# Altium project insulated_dc-dc_200W.PrjPcb
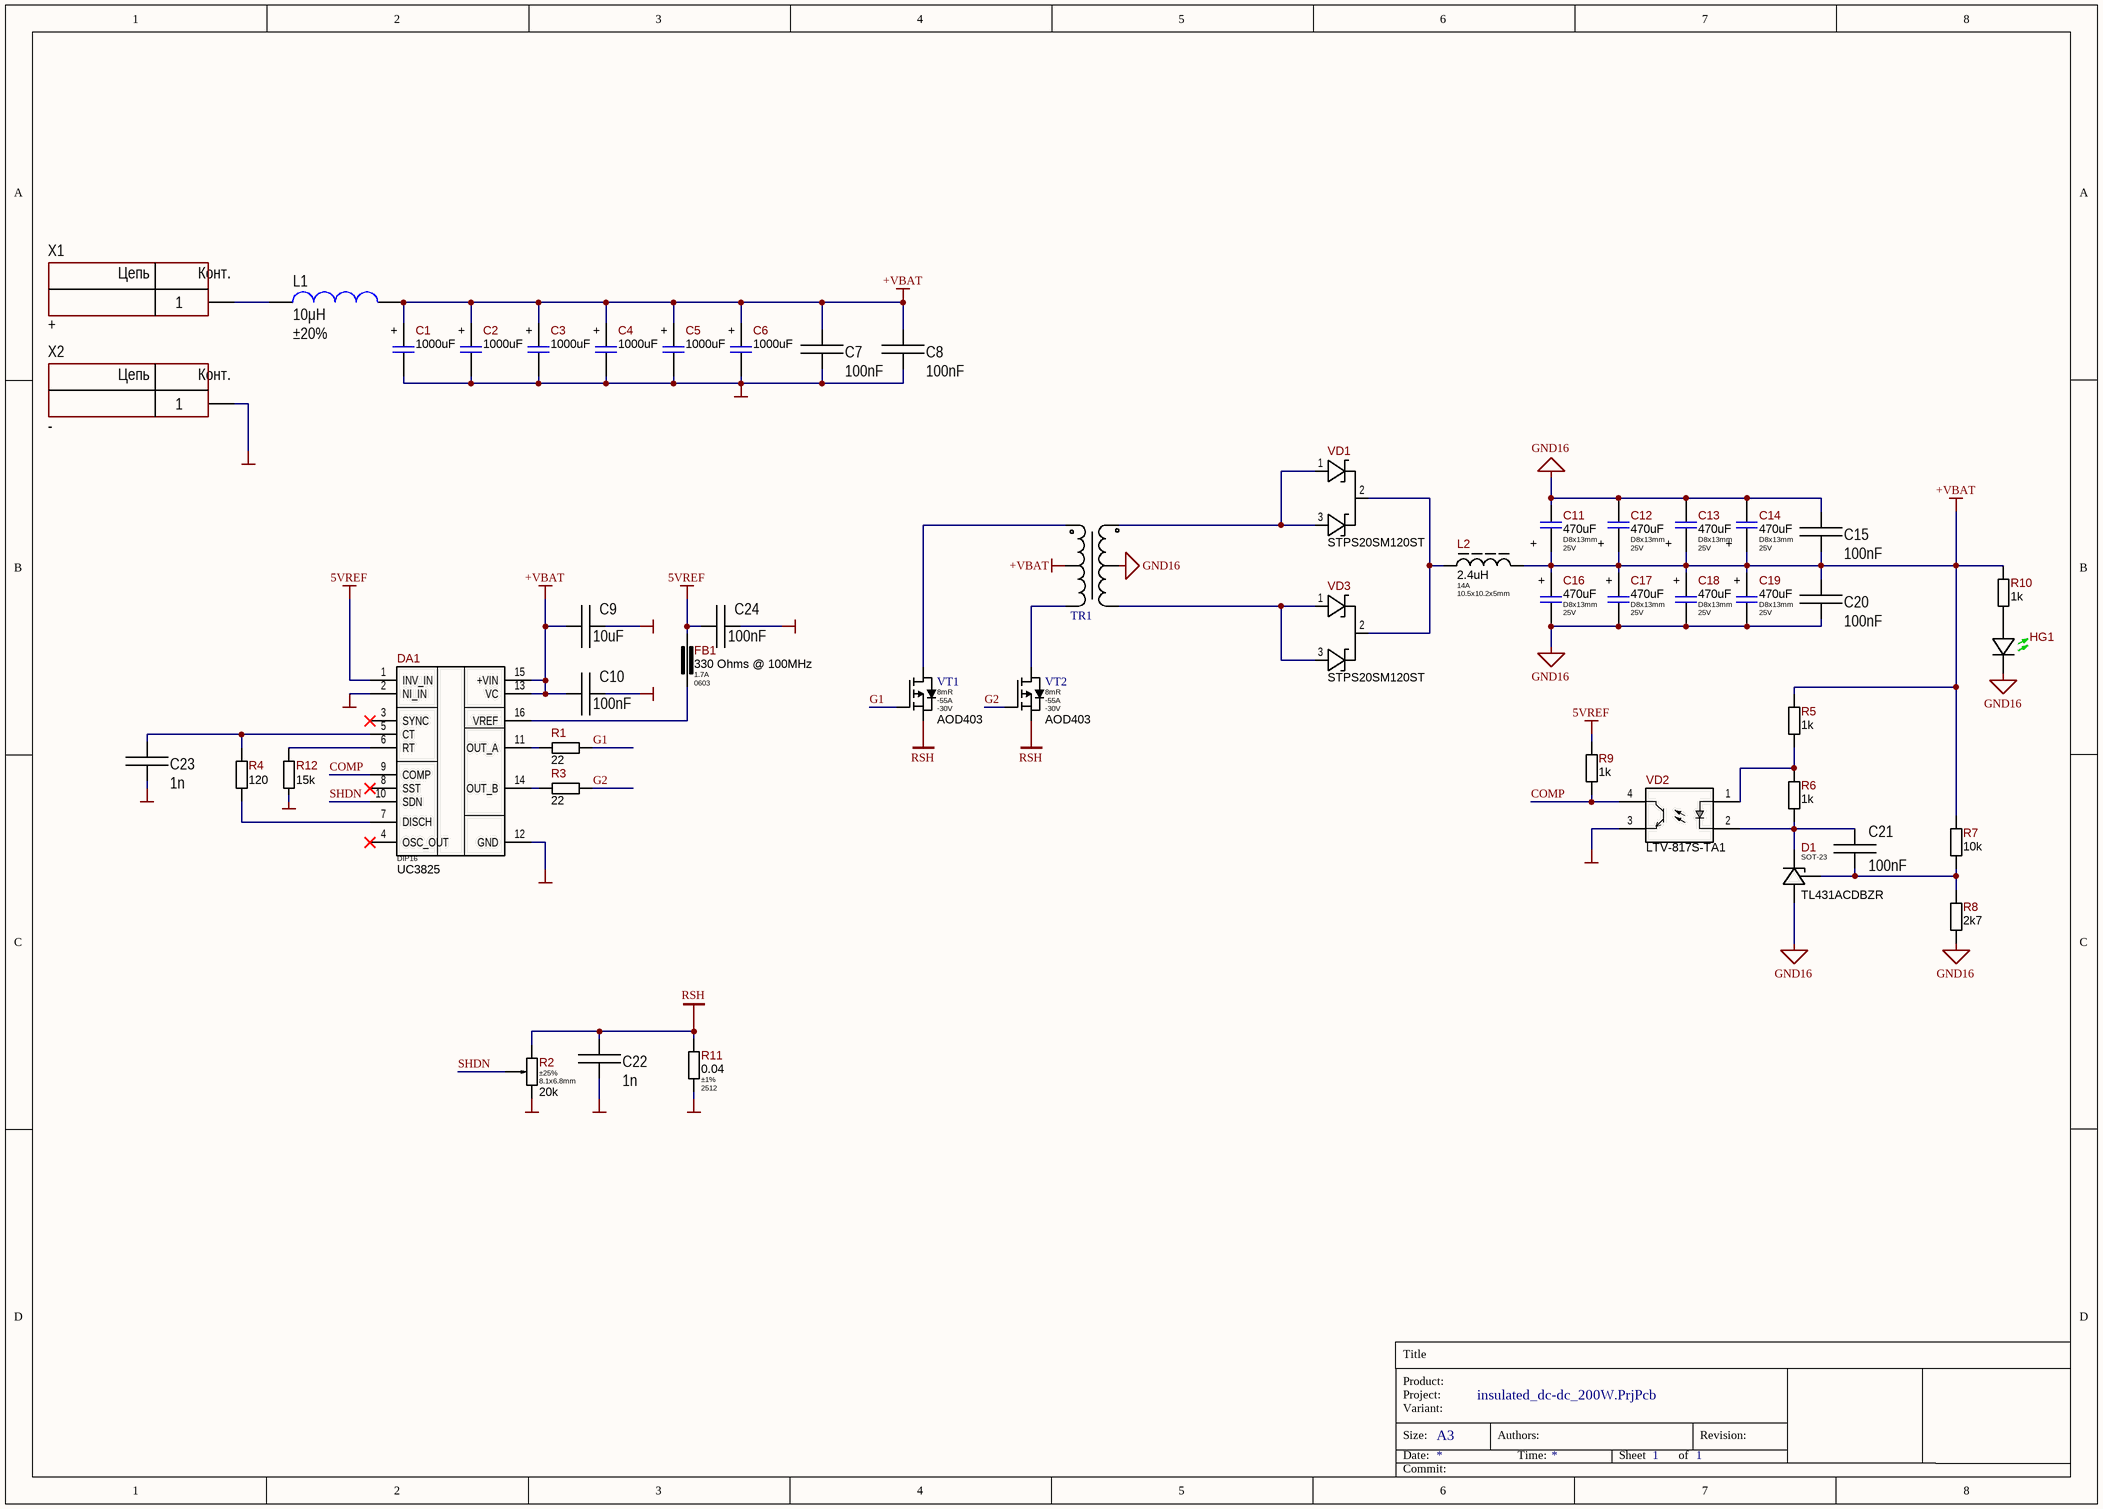
[diagram p0: main.SchDoc]
__Project_Template_Version: 1.0.2; _Amount_Boards_Per_Stand: 1; _PCB_Order_Accuracy: 0.2mm / 8mil; _PCB_Order_BoardOutlineLayer: Mechanical1 (GM1); _PCB_Order_Cooper: 1oz / 35um; _PCB_Order_ElectricTest: Necessarily for 100% samples; _PCB_Order_Finish: HASL; _PCB_Order_LayersCnt: 2; _PCB_Order_Mask: on both sides; _PCB_Order_MaskColor: Green / Yellow; _PCB_Order_Material: FR-4; _PCB_Order_MinHole: 0.3 mm; _PCB_Order_ProductionTime: 2 weeks; _PCB_Order_Silk: No; _PCB_Order_SilkColor: No; _PCB_Order_Size: 0 x 0 mm; _PCB_Order_Thickness: 1.6 mm; Authors: Starovit; Product_Name: INS.DCDC; Project_ID: 1; Project_Version: 1
1 sheet, 50 parts. Net scope: global (net labels, ports and power ports of the same name join across sheets).
Board file: pcb_2Layer.PcbDoc

## Sheet main.SchDoc: =DocumentName
size A3; Author: Starovit; CompanyName: "AS Manufacturing" LLC; Organization: "AS Manufacturing" LLC; Address1: 5 Sklyarenka St.; Address2: Kyiv 04073; Address3: Ukraine; Address4: https://ajax.systems/en/; Revision: v1; SheetNumber: 1; SheetTotal: 1; Product name: INS.DCDC; Internal reference: 1; Head: INS.DCDC.1.v1; PCB_Designator: INS.DCDC.1.v1; Template_version: 1.0.1

### Parts
C1  value 1000uF  [CAP-AE-PTH-100D05x200H20]  (hidden comment: 1000uFx25V)
C2  value 1000uF  [CAP-AE-PTH-100D05x200H20]  (hidden comment: 1000uFx25V)
C3  value 1000uF  [CAP-AE-PTH-100D05x200H20]  (hidden comment: 1000uFx25V)
C4  value 1000uF  [CAP-AE-PTH-100D05x200H20]  (hidden comment: 1000uFx25V)
C5  value 1000uF  [CAP-AE-PTH-100D05x200H20]  (hidden comment: 1000uFx25V)
C6  value 1000uF  [CAP-AE-PTH-100D05x200H20]  (hidden comment: 1000uFx25V)
C7  value 100nF  [CAP: MKS2 (W=2.50MM)]
C8  value 100nF  [CAP: MKS2 (W=2.50MM)]
C9  value 10uF  [CAP: MKS2 (W=2.50MM)]
C10  value 100nF  [CAP: MKS2 (W=2.50MM)]
C11  value 470uF  Package: D8x13mm  Voltage: 25V  [CAP-AE-PTH-80D05x130H15]  (hidden comment: 470uFx25V)
C12  value 470uF  Package: D8x13mm  Voltage: 25V  [CAP-AE-PTH-80D05x130H15]  (hidden comment: 470uFx25V)
C13  value 470uF  Package: D8x13mm  Voltage: 25V  [CAP-AE-PTH-80D05x130H15]  (hidden comment: 470uFx25V)
C14  value 470uF  Package: D8x13mm  Voltage: 25V  [CAP-AE-PTH-80D05x130H15]  (hidden comment: 470uFx25V)
C15  value 100nF  [CAP: MKS2 (W=2.50MM)]
C16  value 470uF  Package: D8x13mm  Voltage: 25V  [CAP-AE-PTH-80D05x130H15]  (hidden comment: 470uFx25V)
C17  value 470uF  Package: D8x13mm  Voltage: 25V  [CAP-AE-PTH-80D05x130H15]  (hidden comment: 470uFx25V)
C18  value 470uF  Package: D8x13mm  Voltage: 25V  [CAP-AE-PTH-80D05x130H15]  (hidden comment: 470uFx25V)
C19  value 470uF  Package: D8x13mm  Voltage: 25V  [CAP-AE-PTH-80D05x130H15]  (hidden comment: 470uFx25V)
C20  value 100nF  [CAP: MKS2 (W=2.50MM)]
C21  value 100nF  [CAP: MKS2 (W=2.50MM)]
C22  value 1n  [CAP: MKS2 (W=2.50MM)]
C23  value 1n  [CAP: MKS2 (W=2.50MM)]
C24  value 100nF  [CAP: MKS2 (W=2.50MM)]
D1  Package: SOT-23  [SOT-23_MED]  (hidden comment: TL431ACDBZR)
DA1  Part Number: UC3825  [DIP16]  (hidden comment: UC3525)
FB1  value 330 Ohms @ 100MHz  Current: 1.7A  Package: 0603  [BLM18-Series_H80T15]  (hidden comment: BLM18KG331SH1D)
HG1  LTST-C171GKT  [LTST-C171GKT]  (value not drawn)
L1  value 10μH  Tolerance: ±20%  [IND: R22.9/14/7.62 (H)]
L2  Current: 14A  Package: 10.5x10.2x5mm  [744325240]  (hidden comment: 2.4uH)
R1  22  [R_ANY_CHIP_0805_MED]
R2  Tolerance: ±25%  Package: 8.1x6.8mm  [3306F-1-xxx]  (hidden comment: 20k)
R3  22  [R_ANY_CHIP_0805_MED]
R4  120  [R_ANY_CHIP_0805_MED]
R5  1k  [R_ANY_CHIP_0805_MED]
R6  1k  [R_ANY_CHIP_0805_MED]
R7  value 10k  [R_ANY_CHIP_0805_MED]  (hidden comment: 22)
R8  2k7  [R_ANY_CHIP_0805_MED]
R9  1k  [R_ANY_CHIP_0805_MED]
R10  1k  [R_ANY_CHIP_0805_MED]
R11  value 0.04  Tolerance: ±1%  Package: 2512  [HoLLR2512-Series]  (hidden comment: 40mOhm)
R12  15k  [R_ANY_CHIP_0805_MED]
TR1  TR  [TR: R32.8/20.1/10.7 (L) - MidPoint - 2]  (value not drawn)
VD1  Part Number: STPS20SM120ST  [TO220(H)]  (hidden comment: DIODE SCHOTTKY)
VD2  LTV-817S-TA1  [LTV-817S-TA1_REC]
VD3  Part Number: STPS20SM120ST  [TO220(H)]  (hidden comment: DIODE SCHOTTKY)
VT1  Rds: 8mR  Id: -55А  Vds: -30V  [TO220(H)]  (hidden comment: AOD403)
VT2  Rds: 8mR  Id: -55А  Vds: -30V  [TO220(H)]  (hidden comment: AOD403)
X1  CommentText: +  [CON: 8191]
X2  (no value)  [CON: 8191]

### Nets
5VREF: C24.1 DA1.1(INV_IN) FB1.2 R9.2
+VBAT: C1.1 C2.1 C3.1 C4.1 C5.1 C6.1 C7.1 C8.1 C9.1 C10.1 C11.1 C12.1 C13.1 C14.1 C16.1 C17.1 C18.1 C19.1 C20.1 DA1.13(VC) DA1.15(+VIN) L1.1 L2.2 R5.2 R7.2 R10.2 TR1.3
GND: C1.2 C2.2 C3.2 C4.2 C5.2 C6.2 C7.2 C9.2 C10.2 C22.1 C23.2 C24.2 DA1.2(NI_IN) DA1.12(GND) R2.1(CCW) R11.2 R12.1 VD2.3(Emitter) X2.1
GND16: C11.2 C12.2 C13.2 C14.2 C15.1 C16.2 C17.2 C18.2 C19.2 C20.2 D1.3(A) HG1.CA(Cathode) R8.1 TR1.6
RSH: C22.2 R2.3(CW) R11.1 VT1.3(S) VT2.3(S)
COMP: DA1.9(COMP) R9.1 VD2.4(Collector)
G1: R1.2 VT1.1(G)
G2: R3.2 VT2.1(G)
SHDN: DA1.10(SDN) R2.2(WIPER)
NetC21_1: C21.1 D1.1(C) R6.1 VD2.2(Cathode)
NetC21_2: C21.2 D1.2(REF) R7.1 R8.2
NetC23_1: C23.1 DA1.5(CT) R4.2
NetDA1_6: DA1.6(RT) R12.2
NetDA1_7: DA1.7(DISCH) R4.1
NetDA1_11: DA1.11(OUT_A) R1.1
NetDA1_14: DA1.14(OUT_B) R3.1
NetDA1_16: DA1.16(VREF) FB1.1
NetHG1_AN: HG1.AN(Anode) R10.1
NetL1_2: L1.2 X1.1
NetL2_1: L2.1 VD1.2(Cathode) VD3.2(Cathode)
NetR5_1: R5.1 R6.2 VD2.1(Anode)
NetTR1_1: TR1.1 VT1.2(D)
NetTR1_2: TR1.2 VT2.2(D)
NetTR1_4: TR1.4 VD1.1(Anode_1) VD1.3(Anode_2)
NetTR1_5: TR1.5 VD3.1(Anode_1) VD3.3(Anode_2)

Not connected (* = marked no-connect by the designer): C8 2; C15 2; DA1 3(SYNC)* 4(OSC_OUT)* 8(SST)*

### Notes on the sheet
- Title
- Product:
- Project:
- Size:
- Date:
- Variant:
- A3
- Authors:
- Time:
- Sheet
- of
- Revision:
- Commit:
- (in symbol Connector_single_power) Цепь; Конт.
- (in symbol ESH108M025AH4AA) +
- (in symbol KS-025V471MF130) +

### Library data of the parts
C1-C6 = ESH108M025AH4AA: 1000uF 25V ±20% Aluminum Electrolytic Capacitors Radial, 2000 Hrs @ 105°C, 740mA Ripple Current; Manufacturer: Kemet; Ajax_1C_PN: NONE; Ajax_1С_Status: RND Only; Standard Lead Time: 30 Weeks; Component Status: Released; Package: D10x20mm; Voltage: 25V; Part Number: ESH108M025AH4AA; Part Type: Aluminum; Component Type: PTH; Temperature Range: -40°C ~ 105°C; Tolerance: ±20%; Dielectric Type: NONE; ComponentLink1URL: https://eu.mouser.com/datasheet/2/212/KEM_A4005_ESH-1101279.pdf; Supplier 1: Mouser; Supplier Part Number 1: 80-ESH108M025AH4AA; Replacement: NONE; Price: NONE; ComponentLink1Description: Datasheet
C7 C8 C10 C15 C20 C21 C24 = Film: Manufacturer: Epcos; PartNumber: B32774D4106K000; ValueManufacturerPartNumber: Film capacitor, 100nF, 450VDC, ±10%, 10.9mOhm, 31.5x15 mm, -40...+105°C; TypeCapacitor: Film capacitor; Tolerance: ±10%; Impedance: 10.9mOhm; Voltage: 450VDC; Package: 31.5x15 mm; HelpURL: https://www.digikey.com/products/en/capacitors/film-capacitors/62?k=&pkeyword=&sv=0&pv2097=1958&sf=0&FV=fffc01ef%2C1f140000%2Cffe0003e%2Cffec6366&quantity=1&ColumnSort=1000011&page=1&stock=1&pageSize=25; Temperature: -40...+105°C
C9 = Film: Manufacturer: Epcos; PartNumber: B32774D4106K000; ValueManufacturerPartNumber: Film capacitor, 10uF, 450VDC, ±10%, 10.9mOhm, 31.5x15 mm, -40...+105°C; TypeCapacitor: Film capacitor; Tolerance: ±10%; Impedance: 10.9mOhm; Voltage: 450VDC; Package: 31.5x15 mm; HelpURL: https://www.digikey.com/products/en/capacitors/film-capacitors/62?k=&pkeyword=&sv=0&pv2097=1958&sf=0&FV=fffc01ef%2C1f140000%2Cffe0003e%2Cffec6366&quantity=1&ColumnSort=1000011&page=1&stock=1&pageSize=25; Temperature: -40...+105°C
C11-C14 C16-C19 = KS-025V471MF130: 470uF 25V ±20% D8x13mm Conductive Polymer Aluminum Solid Capacitor, 2000 Hrs @ 105°C, 4100mA Ripple Current; Manufacturer: Koshin; Ajax_1C_ID: 45913; Ajax_1C_PN: 470uF 25V 20% Low ESR 8x13mm (KS-025V471MF130 - Koshin) Aluminium Capacitors; Ajax_1С_Status: Mass Production; Component Status: Released; Dielectric Type: NONE; GUID_1C: 2652f362-010b-11ed-a361-005056994834; Part Number: KS-025V471MF130; Part Type: Aluminum; Component Type: PTH; Temperature Range: -55°C ~ 105°C; Tolerance: ±20%; ComponentLink1URL: \\altiumdb.ajax.local\files\Datasheet\Capacitor\KS-Series.pdf; Replacement: NONE; Price: 0.07; ComponentLink1Description: Datasheet
C22 C23 = Film: Manufacturer: Epcos; PartNumber: B32774D4106K000; ValueManufacturerPartNumber: Film capacitor, 1n, 450VDC, ±10%, 10.9mOhm, 31.5x15 mm, -40...+105°C; TypeCapacitor: Film capacitor; Tolerance: ±10%; Impedance: 10.9mOhm; Voltage: 450VDC; Package: 31.5x15 mm; HelpURL: https://www.digikey.com/products/en/capacitors/film-capacitors/62?k=&pkeyword=&sv=0&pv2097=1958&sf=0&FV=fffc01ef%2C1f140000%2Cffe0003e%2Cffec6366&quantity=1&ColumnSort=1000011&page=1&stock=1&pageSize=25; Temperature: -40...+105°C
D1 = TL431ACDBZR: Adjustable Precision Shunt Regulator, Accuracy 1%,  SOT-23-3; Manufacturer: Texas Instruments; Ajax_1C_ID: 6287; Ajax_1C_PN: TL431ACDBZR (SOT-23); Ajax_1С_Status: Mass Production; Standard Lead Time: 8 Weeks; Component Status: Released; Replacement: NONE; GUID_1C: b426e85d-df70-11e4-9f89-a45d36c4a9e5; Part Number: TL431ACDBZR; Part Type: Voltage Reference; Component Type: SMD; Temperature Range: 0°C ~ 70°C; ComponentLink1URL: https://www.ti.com/lit/ds/symlink/tl431.pdf; Supplier 1: Digi-Key; Supplier Part Number 1: 296-17328-1-ND; Price: 0.046; ComponentLink1Description: Datasheet
DA1 = UC3525: Buck, Push-Pull Regulator Positive Output Step-Down, Step-Up/Step-Down DC-DC Controller IC 16-DIP/16-SOIC; Manufacturer: Texas; Standard Lead Time: 8 Weeks; Component Status: Released; Replacement: NONE; GUID_1C: 956a5446-e932-11eb-ab74-0050569f2651; Part Type: IC REG CTRLR BCK/PUSH-PULL; Component Type: SMD; Temperature Range: -40°C ~ 125°C; ComponentLink1URL: https://assets.nexperia.com/documents/data-sheet/74HC_HCT4051.pdf; Supplier 1: Digi-Key; Supplier Part Number 1: 1727-6049-2-ND; Price: 0.11383574; ComponentLink1Description: Datasheet; Package: DIP16
FB1 = BLM18KG331SH1D: 330 Ohms @ 100 MHz Power Line Ferrite Bead 0603, 1.7A 80mOhm; Manufacturer: Murata Electronics; Ajax_1C_ID: 31487; Ajax_1C_PN: 330R 1.7A BLM18KG331SH1D 0603 Murata Ferrite Bead; Ajax_1С_Status: RND Only; Saturation Current: NONE; Tolerance: ±25%; Component Status: Released; Standard Lead Time: 15 Weeks; GUID_1C: 8fa34a67-d98f-11eb-ab74-0050569f2651; Part Number: BLM18KG331SH1D; Part Type: Ferrite Bead; Component Type: SMD; Temperature Range: -55°C ~ 125°C; ComponentLink1URL: https://www.murata.com/en-us/products/productdata/8796737273886/QNFA9101.pdf; Supplier 1: Digi-Key; Supplier Part Number 1: 490-13257-2-ND; Replacement: NONE; Price: 0.0072; ComponentLink1Description: Datasheet
HG1 = LTST-C171GKT: Low Power LED, Green 565nm, Clear, SMD 0805, Vf 2.1V - 2.6V, 5 ~ 12mcd @ 20 mA, 130°; Manufacturer: Lite-On Optoelectronics; Ajax_1C_ID: 30364; Ajax_1C_PN: LTST-C171GKT Green SMD LED 0805 12mcd 20mA 130deg RoHS; Ajax_1С_Status: RND Only; Component Status: Released; Replacement: NONE; GUID_1C: df39881f-c399-11eb-ab74-0050569f2651; Part Number: LTST-C171GKT; Color: Green; Part Type: LED / 0805; Component Type: SMD; Package: 0805; Wavelength: 565nm; Temperature Range: -55°C ~ 85°C; ComponentLink1URL: https://media.digikey.com/pdf/Data%20Sheets/Lite-On%20PDFs/LTST-C171GKT.pdf; Supplier 1: Digi-Key; Supplier Part Number 1: 160-1423-2-ND; Price: 0.06; ComponentLink1Description: Datasheet
L1 = Inductor_R22.9/14/7.62: Manufacturer: Magnetics; PartNumber: 0077310A7; ValueManufacturerPartNumber: Fixed inductor, 10μH, ±20%, R22.9/14/7.62, Kool Mu, µ=125, 90 нГн/витков2; TypeInductor: Fixed inductor; TypeMatiriel: Kool Mu; AL: 90 нГн/витков2; MaterialPermeability: µ=125; Package: R22.9/14/7.62; HelpURL: http://ferrite.ru/warehouse/r-22-9147-62-77310-a7.html
L2 = 744325240: 2.4uH Shielded Wirewound Inductor 14A 4.75mOhm Max, 10.5x10.2mm, Height 5mm Max; Manufacturer: Wurth Elektronik; Ajax_1C_ID: 66330; Ajax_1C_PN: 2.4uH 14A 20% 744325240 Wurth SMD Inductor; Ajax_1С_Status: RND Only; Saturation Current: 17A; Tolerance: ±20%; Component Status: Released; Standard Lead Time: 26 Weeks; Replacement: NONE; GUID_1C: 708811f9-d448-11ed-a36c-005056994834; Value: 2.4uH; Part Number: 744325240; Part Type: Power / Iron Powder Core; Component Type: SMD; Temperature Range: -40°C ~ 150°C; ComponentLink1URL: https://eu.mouser.com/datasheet/2/445/744325240-3093497.pdf; Supplier 1: Digi-Key; Supplier Part Number 1: 732-1168-2-ND; Price: 4.27; ComponentLink1Description: Datasheet
R1 R3-R10 R12 = RC0805JR-0722RL: 22 Ohms ±5%, 1/8W 0805 Thick Film Resistor; Manufacturer: Yageo; Ajax_1C_ID: 8822; Ajax_1C_PN: 22R 5% 0805 Resistors SMD RoHS; Ajax_1С_Status: Mass Production; Power Rating: 0.125W; Voltage: 150V; Component Status: Released; Temperature Stability: ±100ppm/°C; Replacement: NONE; GUID_1C: 3ba40fec-5951-11e6-81ec-d8cb8a9acc66; Tolerance: ±5%; Package: 0805; Part Number: RC0805JR-0722RL; Component Type: SMD; Part Type: Thick Film; Temperature Range: -55°C ~ 155°C; ComponentLink1URL: https://eu.mouser.com/datasheet/2/447/PYu_RC_Group_51_RoHS_L_10-1664068.pdf; Price: 0.0011; ComponentLink1Description: Datasheet
  R1 R3: Value: 22
  R4: Value: 120
  R5 R6 R9 R10: Value: 1k
  R8: Value: 2k7
  R12: Value: 15k
R2 = 3306F-1-203: 20 kOhms ±25%, 0.2W, PTH Trimmer Potentiometer, Cermet, Turn Top Adjustment; Manufacturer: Bourns; Ajax_1C_PN: NONE; Ajax_1С_Status: RND Only; Component Status: On Review; Temperature Stability: ±250ppm/°C; Value: 20k; Part Number: 3306F-1-203; Component Type: PTH; Part Type: Trimming Potentiometer; Power Rating: 0.2W; Temperature Range: -25°C ~ 100°C; ComponentLink1URL: https://www.bourns.com/docs/Product-Datasheets/3306.pdf; Supplier 1: Digi-Key; Supplier Part Number 1: 3306F-1-203; Replacement: NONE; Price: NONE; ComponentLink1Description: Datasheet
R11 = HoLLR2512-2W-40mR-1%: 40mOhm ±1%, 2W Surface Mount 77.5A ±50ppm 2512 Encapsulated Metal Alloy Current Sense Resistors; Manufacturer: Milliohm; Ajax_1C_PN: NONE; Ajax_1С_Status: RND Only; Component Status: Released; Temperature Stability: ±50ppm/°C; Part Number: HoLLR2512-2W-40mR-1%; Component Type: SMD; Part Type: Metal Alloy; Power Rating: 2W; Voltage: NONE; Temperature Range: -55°C ~ 170°C; ComponentLink1URL: https://datasheet.lcsc.com/lcsc/2204121445_Milliohm-HoLLR2512-2W-40mR-1-_C2994633.pdf; Supplier 1: LCSC; Supplier Part Number 1: C2994633; Replacement: NONE; Price: NONE; ComponentLink1Description: Datasheet
TR1 = Toroidal Transformator Midpoint_1: Manufacturer: Handmade; Part Number: RLB0914-3R3ML-ND; Saturation Current: 11.3A; Tolerance: ±20%; ComponentLink1Description: Datasheet; ComponentLink1URL: https://www.vishay.com/docs/34193/ihlp-4040dz-01.pdf
VD1 VD3 = DIODE SCHOTTKY: Diode Schottky Array 1 Pair Common Cathode, 120V 20A, TO-220; Manufacturer: STMicroelectronics; Marking: STPS20SM120; Component Status: Released; Standard Lead Time: 11 Weeks; Vf: 0.75V @ 10A; Replacement: NONE; Voltage: 120V; Part Type: Schottky; Component Type: PTH; Package: TO-220AB; Current: 20A; Temperature Range: -65°C ~ 150°C; ComponentLink1URL: https://www.st.com/resource/en/datasheet/stps20sm120s.pdf; Supplier 1: Digi-Key; Supplier Part Number 1: 497-15563-5-ND; Price: NONE; ComponentLink1Description: Datasheet
VD2 = LTV-817S-TA1: 1-Channel Photocoupler, 5kV, SSOP-4; Manufacturer: Lite-On Optoelectronics; Ajax_1C_ID: 12260; Ajax_1C_PN: LTV-817S-TA1 оптопара; Ajax_1С_Status: Mass Production; Component Status: Released; Wavelength: NONE; Replacement: LTV-816S-TA1; GUID_1C: 36a51d61-3103-11e8-822a-14dda9d2d04d; Part Number: LTV-817S-TA1; Part Type: Optocoupler; Component Type: SMD; Package: SSOP-4; Color: NONE; Temperature Range: -55°C ~ 110°C; ComponentLink1URL: https://optoelectronics.liteon.com/upload/download/DS-70-96-0016/LTV-8X7%20series%20201610%20.pdf; Supplier 1: Digi-Key; Supplier Part Number 1: 160-1893-2-ND; Price: 0.053; ComponentLink1Description: Datasheet
VT1 VT2 = N-CH_MOSFET: P-MOSFET; полевой; -30В; -55А; 45Вт; TO252; Part Type: P-Channel; Component Type: SMD; Package: D-PAK; ComponentLink1Description: Datasheet; ComponentLink1URL: https://www.tme.eu/Document/dd9e9fcbccf7c5b1f5f9da06cbc5bf44/AOD403-DTE.pdf; ComponentLink2Description: imrad; ComponentLink2URL: https://imrad.com.ua/ua/aod403-7?srsltid=AfmBOoqbv76D2b_UWMskTCTCmXEIhcjdT6a5VOgt9k0M-VKdEIqWTw9d; Part Number: AOD403
X1 X2 = Connector_single_power: ValueManufacturerPartNumber: Power connector, *, *; TypeConnector: Power connector; Manufacturer: *; HelpURL: *; PartNumber: *; VoltageMax: *; CurrentMax: *
  X2: CommentText: -